# Altium schematic sheet AuxBoard030610.SchDoc
size A3
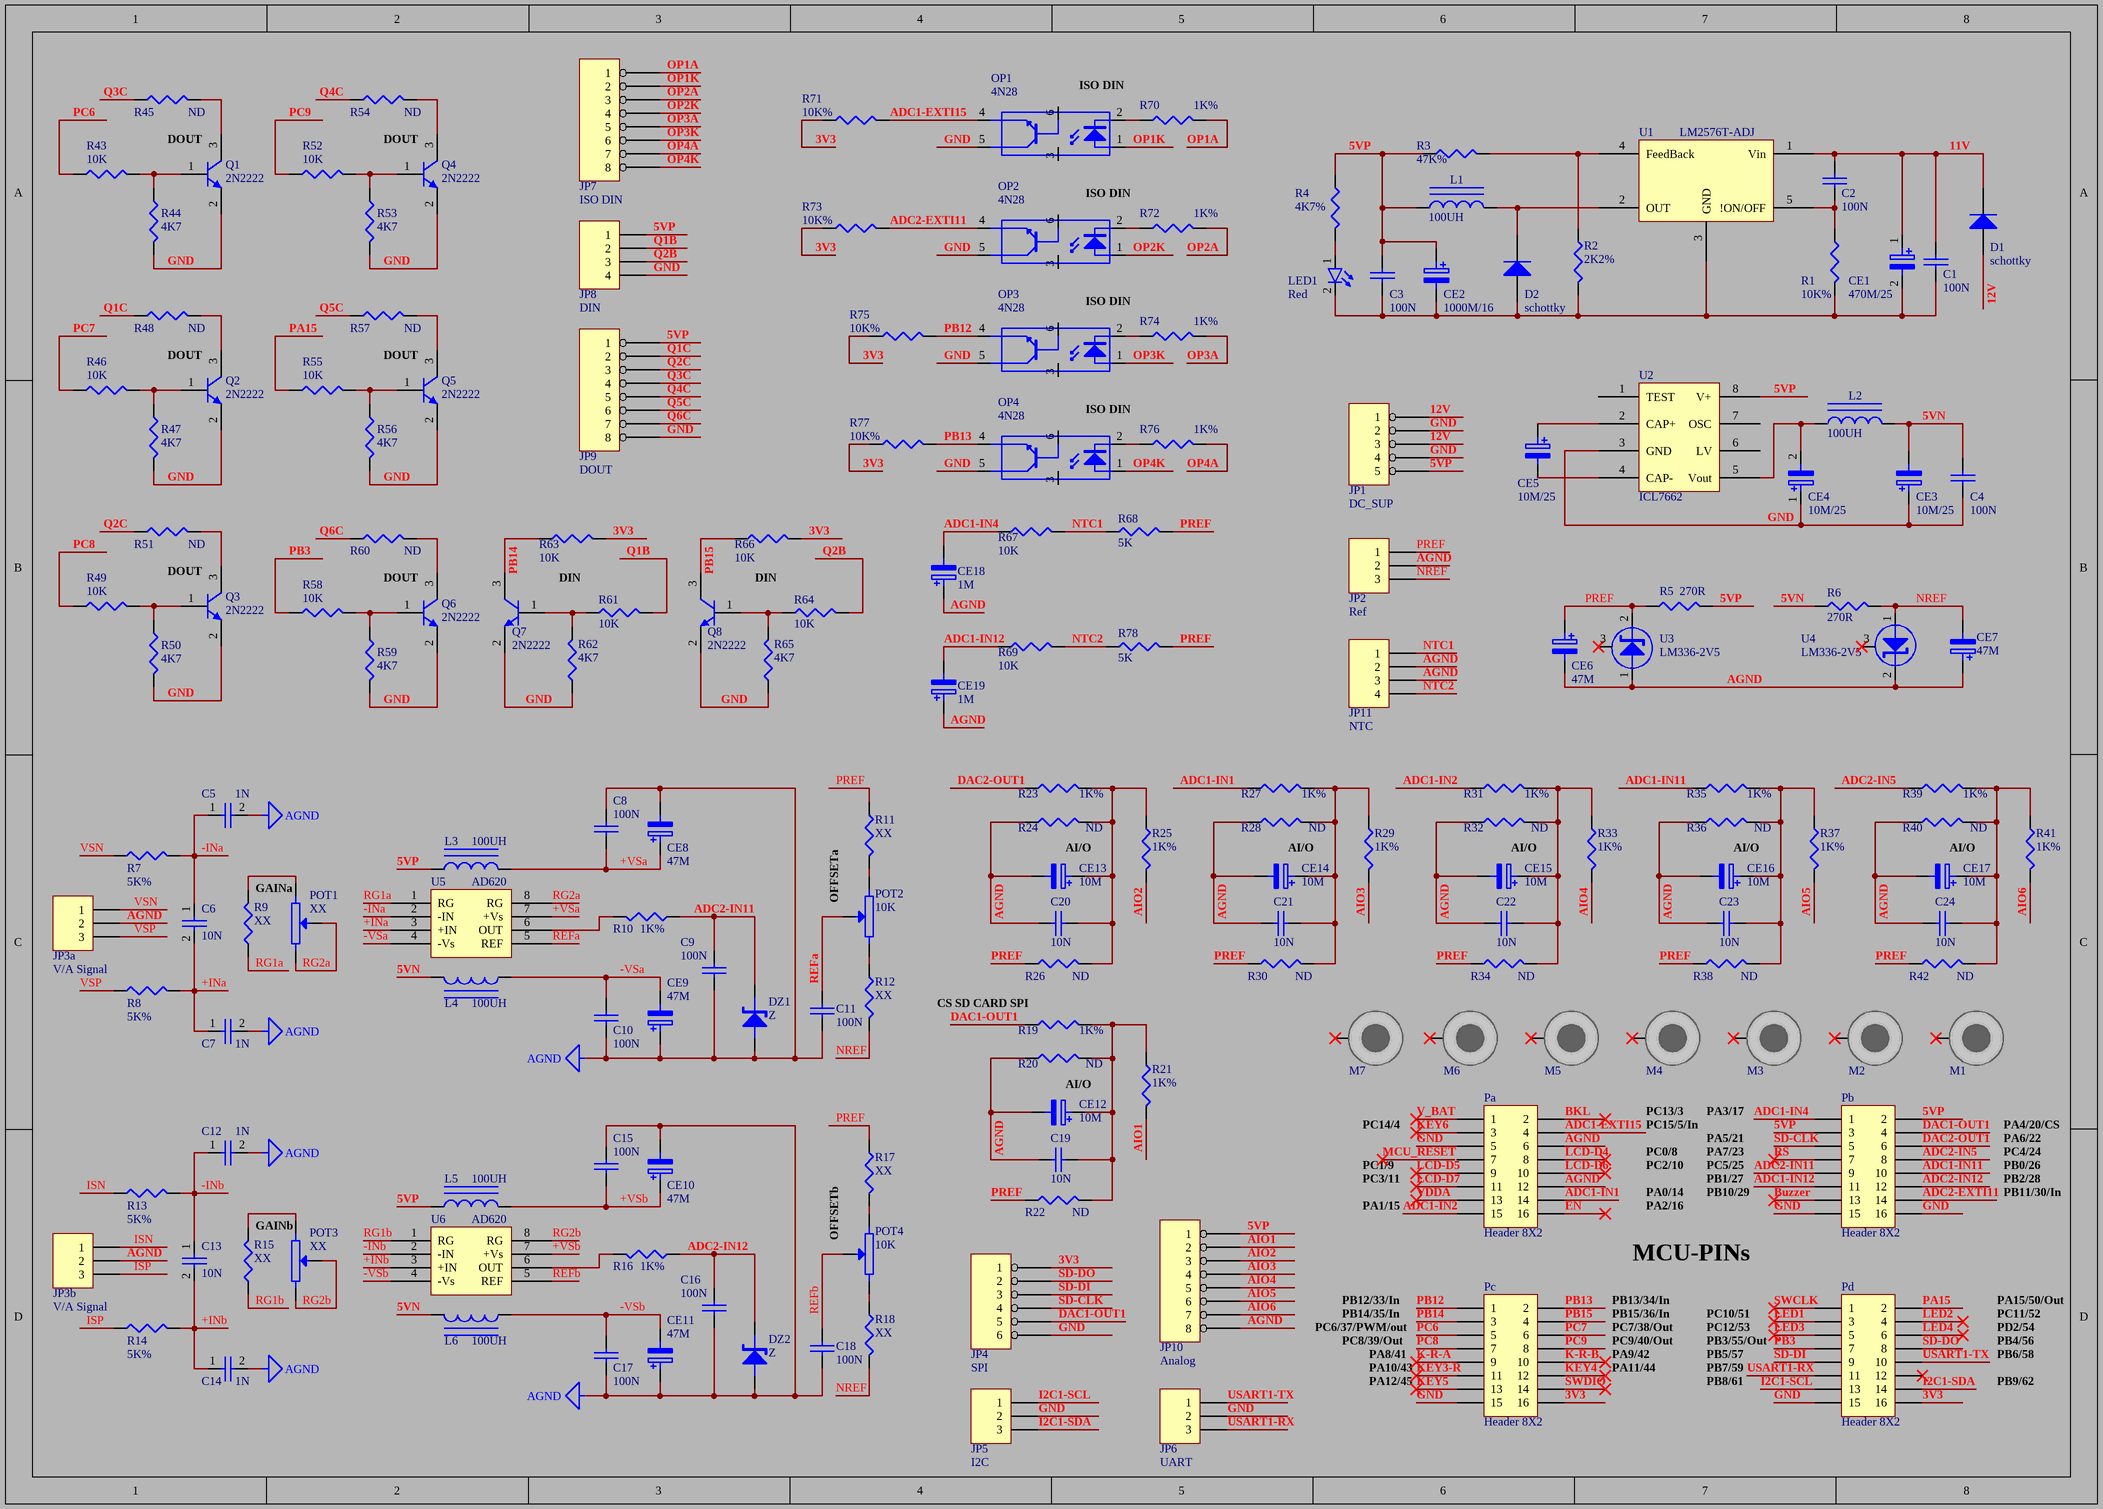
[diagram p0: AuxBoard030610.SchDoc]

## Parts
C1  100N  [C2P]
C2  100N  [SMD_CAP_1206.]
C3  100N  [SMD_CAP_1206.]
C4  100N  [SMD_CAP_1206.]
C5  1N  [SMD_CAP_1206.]
C6  10N  [SMD_CAP_1206.]
C7  1N  [SMD_CAP_1206.]
C8  100N  [SMD_CAP_1206.]
C9  100N  [SMD_CAP_1206.]
C10  100N  [SMD_CAP_1206.]
C11  100N  [SMD_CAP_1206.]
C12  1N  [SMD_CAP_1206.]
C13  10N  [SMD_CAP_1206.]
C14  1N  [SMD_CAP_1206.]
C15  100N  [SMD_CAP_1206.]
C16  100N  [SMD_CAP_1206.]
C17  100N  [SMD_CAP_1206.]
C18  100N  [SMD_CAP_1206.]
C19  10N  [SMD_CAP_1206.]
C20  10N  [SMD_CAP_1206.]
C21  10N  [SMD_CAP_1206.]
C22  10N  [SMD_CAP_1206.]
C23  10N  [SMD_CAP_1206.]
C24  10N  [SMD_CAP_1206.]
CE1  470M/25  [CAP-E-6]
CE2  1000M/16  [CAP-E-6]
CE3  10M/25  [CAP-E-3]
CE4  10M/25  [CAP-E-3]
CE5  10M/25  [CAP-E-3]
CE6  47M  [CAP-E-4]
CE7  47M  [CAP-E-4]
CE8  47M  [CAP-E-4]
CE9  47M  [CAP-E-4]
CE10  47M  [CAP-E-4]
CE11  47M  [CAP-E-4]
CE12  10M  [CAP-E-3]
CE13  10M  [CAP-E-3]
CE14  10M  [CAP-E-3]
CE15  10M  [CAP-E-3]
CE16  10M  [CAP-E-3]
CE17  10M  [CAP-E-3]
CE18  1M  [CAP-E-2]
CE19  1M  [CAP-E-2]
D1  schottky  [SMA-M]
D2  schottky  [SMA-M]
DZ1  Z  [D4P]
DZ2  Z  [D4P]
JP1  DC_SUP  [dsip 5 right]
JP2  Ref  [dsip 3 right]
JP3a  V/A Signal  [dsip 3 right]
JP3b  V/A Signal  [dsip 3 right]
JP4  SPI  [SIP 6 Right]
JP5  I2C  [SIP 3 Right]
JP6  UART  [SIP 3 Right]
JP7  ISO DIN  [dsip 8 right]
JP8  DIN  [dsip 4 right]
JP9  DOUT  [dsip 8 right]
JP10  Analog  [dsip 8 right]
JP11  NTC  [dsip 4 right]
L1  100UH  [INDUCTOR-ylw]
L2  100UH  [r4p]
L3  100UH  [r4p]
L4  100UH  [r4p]
L5  100UH  [r4p]
L6  100UH  [r4p]
LED1  Red  [LED_SMD_1206]
M1  Comment  [Stud-hole]  (value not drawn)  (no BOM)
M2  Comment  [Stud-hole]  (value not drawn)  (no BOM)
M3  Comment  [Stud-hole]  (value not drawn)  (no BOM)
M4  Comment  [Stud-hole]  (value not drawn)  (no BOM)
M5  Comment  [Stud-hole]  (value not drawn)  (no BOM)
M6  Comment  [Stud-hole]  (value not drawn)  (no BOM)
M7  Comment  [Stud-hole]  (value not drawn)  (no BOM)
OP1  4N28  [DIP6]
OP2  4N28  [DIP6]
OP3  4N28  [DIP6]
OP4  4N28  [DIP6]
Pa  Header 8X2  [HDR2X8]
Pb  Header 8X2  [HDR2X8]
Pc  Header 8X2  [HDR2X8]
Pd  Header 8X2  [HDR2X8]
POT1  XX  [pot multi turn]
POT2  10K  [pot multi turn]
POT3  XX  [pot multi turn]
POT4  10K  [pot multi turn]
Q1  2N2222  [2N2222]
Q2  2N2222  [2N2222]
Q3  2N2222  [2N2222]
Q4  2N2222  [2N2222]
Q5  2N2222  [2N2222]
Q6  2N2222  [2N2222]
Q7  2N2222  [2N2222]
Q8  2N2222  [2N2222]
R1  10K%  [RES_1206]
R2  2K2%  [RES_1206]
R3  47K%  [RES_1206]
R4  4K7%  [RES_1206]
R5  270R  [RES_1206]
R6  270R  [RES_1206]
R7  5K%  [R4P]
R8  5K%  [R4P]
R9  XX  [R4P]
R10  1K%  [RES_1206]
R11  XX  [RES_1206]
R12  XX  [RES_1206]
R13  5K%  [R4P]
R14  5K%  [R4P]
R15  XX  [R4P]
R16  1K%  [RES_1206]
R17  XX  [RES_1206]
R18  XX  [RES_1206]
R19  1K%  [RES_1206]
R20  ND  [RES_1206]
R21  1K%  [RES_1206]
R22  ND  [RES_1206]
R23  1K%  [RES_1206]
R24  ND  [RES_1206]
R25  1K%  [RES_1206]
R26  ND  [RES_1206]
R27  1K%  [RES_1206]
R28  ND  [RES_1206]
R29  1K%  [RES_1206]
R30  ND  [RES_1206]
R31  1K%  [RES_1206]
R32  ND  [RES_1206]
R33  1K%  [RES_1206]
R34  ND  [RES_1206]
R35  1K%  [RES_1206]
R36  ND  [RES_1206]
R37  1K%  [RES_1206]
R38  ND  [RES_1206]
R39  1K%  [RES_1206]
R40  ND  [RES_1206]
R41  1K%  [RES_1206]
R42  ND  [RES_1206]
R43  10K  [RES_1206]
R44  4K7  [RES_1206]
R45  ND  [RES_1206]
R46  10K  [RES_1206]
R47  4K7  [RES_1206]
R48  ND  [RES_1206]
R49  10K  [RES_1206]
R50  4K7  [RES_1206]
R51  ND  [RES_1206]
R52  10K  [RES_1206]
R53  4K7  [RES_1206]
R54  ND  [RES_1206]
R55  10K  [RES_1206]
R56  4K7  [RES_1206]
R57  ND  [RES_1206]
R58  10K  [RES_1206]
R59  4K7  [RES_1206]
R60  ND  [RES_1206]
R61  10K  [RES_1206]
R62  4K7  [RES_1206]
R63  10K  [RES_1206]
R64  10K  [RES_1206]
R65  4K7  [RES_1206]
R66  10K  [RES_1206]
R67  10K  [RES_1206]
R68  5K  [RES_1206]
R69  10K  [RES_1206]
R70  1K%  [RES_1206]
R71  10K%  [RES_1206]
R72  1K%  [RES_1206]
R73  10K%  [RES_1206]
R74  1K%  [RES_1206]
R75  10K%  [RES_1206]
R76  1K%  [RES_1206]
R77  10K%  [RES_1206]
R78  5K  [RES_1206]
U1  LM2576T-ADJ  [D2PACK_TO263-5]
U2  ICL7662  [DIP8]
U3  LM336-2V5  [lm336]
U4  LM336-2V5  [lm336]
U5  AD620  [DIP8]
U6  AD620  [DIP8]

## Nets
AGND: C5.2 C7.2 C8.1 C9.2 C10.2 C11.2 C12.2 C14.2 C15.1 C16.2 C17.2 C18.2 C19.2 C20.2 C21.2 C22.2 C23.2 C24.2 CE6.2 CE7.1 CE8.2 CE9.1 CE10.2 CE11.1 CE12.2 CE13.2 CE14.2 CE15.2 CE16.2 CE17.2 CE18.1 CE19.1 DZ1.1(A) DZ2.1(A) JP2.2 JP3a.2 JP3b.2 JP10.8 JP11.2 JP11.3 Pa.6 Pa.12 R20.1 R24.1 R28.1 R32.1 R36.1 R40.1 U3.1 U4.2
3V3: JP4.1 Pc.16 Pd.16 R63.1 R66.1 R71.2 R73.2 R75.2 R77.2
5VN: C4.1 CE3.2 L2.2 L4.1 L6.1 R6.2
5VP: C3.1 CE2.1 JP1.5 JP8.1 JP9.1 JP10.1 L1.1 L3.1 L5.1 Pb.2 Pb.3 R3.1 R4.1 R5.2 U2.8(V+)
11V: C1.1 C2.1 CE1.1 D1.2(K) U1.1(Vin)
12V: D1.1(A) JP1.1 JP1.3
+INa: C6.2 C7.1 R8.2 U5.3(+IN)
+INb: C13.2 C14.1 R14.2 U6.3(+IN)
+VSa: C8.2 CE8.1 L3.2 U5.7(+Vs)
+VSb: C15.2 CE10.1 L5.2 U6.7(+Vs)
-INa: C5.1 C6.1 R7.2 U5.2(-IN)
-INb: C12.1 C13.1 R13.2 U6.2(-IN)
-VSa: C10.1 CE9.2 L4.2 U5.4(-Vs)
-VSb: C17.1 CE11.2 L6.2 U6.4(-Vs)
ADC1-EXTI15: OP1.4(E) Pa.4 R71.1
ADC1-IN1: Pa.14 R27.1
ADC1-IN2: Pa.15 R31.1
ADC1-IN4: CE18.2 Pb.1 R67.2
ADC1-IN11: Pb.10 R35.1
ADC1-IN12: CE19.2 Pb.11 R69.2
ADC2-EXTI11: OP2.4(E) Pb.14 R73.1
ADC2-IN5: Pb.8 R39.1
ADC2-IN11: C9.1 DZ1.2(K) Pb.9 R10.1
ADC2-IN12: C16.1 DZ2.2(K) Pb.12 R16.1
AIO1: JP10.2 R21.2
AIO2: JP10.3 R25.2
AIO3: JP10.4 R29.2
AIO4: JP10.5 R33.2
AIO5: JP10.6 R37.2
AIO6: JP10.7 R41.2
BKL: Pa.2
Buzzer: Pb.13
DAC1-OUT1: JP4.5 Pb.4 R19.1
DAC2-OUT1: Pb.6 R23.1
EN: Pa.16
GND: C4.2 CE3.1 CE4.1 JP1.2 JP1.4 JP4.6 JP5.2 JP6.2 JP8.4 JP9.8 OP1.5(C) OP2.5(C) OP3.5(C) OP4.5(C) Pa.5 Pb.15 Pb.16 Pc.15 Pd.15 Q1.2(E) Q2.2(E) Q3.2(E) Q4.2(E) Q5.2(E) Q6.2(E) Q7.2(E) Q8.2(E) R44.2 R47.2 R50.2 R53.2 R56.2 R59.2 R62.2 R65.2 U2.3(GND)
I2C1-SCL: JP5.1 Pd.13
I2C1-SDA: JP5.3 Pd.14
ISN: JP3b.1 R13.1
ISP: JP3b.3 R14.1
K-R-A: Pc.9
K-R-B: Pc.10
KEY3-R: Pc.11
KEY4: Pc.12
KEY5: Pc.13
KEY6: Pa.3
LCD-D4: Pa.8
LCD-D5: Pa.9
LCD-D6: Pa.10
LCD-D7: Pa.11
LED1: Pd.3
LED2: Pd.4
LED3: Pd.5
LED4: Pd.6
NREF: CE7.2 JP2.3 R6.1 R12.2 R18.2 U4.1
NTC1: JP11.1 R67.1 R68.2
NTC2: JP11.4 R69.1 R78.2
OP1A: JP7.1 R70.1
OP1K: JP7.2 OP1.1(A)
OP2A: JP7.3 R72.1
OP2K: JP7.4 OP2.1(A)
OP3A: JP7.5 R74.1
OP3K: JP7.6 OP3.1(A)
OP4A: JP7.7 R76.1
OP4K: JP7.8 OP4.1(A)
PA15: Pd.2 R55.1
PB3: Pd.7 R58.1
PB12: OP3.4(E) Pc.1 R75.1
PB13: OP4.4(E) Pc.2 R77.1
PB14: Pc.3 Q7.3(C) R63.2
PB15: Pc.4 Q8.3(C) R66.2
PC6: Pc.5 R43.1
PC7: Pc.6 R46.1
PC8: Pc.7 R49.1
PC9: Pc.8 R52.1
PREF: CE6.1 JP2.1 R5.1 R11.1 R17.1 R22.1 R26.1 R30.1 R34.1 R38.1 R42.1 R68.1 R78.1 U3.2
Q1B: JP8.2 R61.1
Q1C: JP9.2 R48.2
Q2B: JP8.3 R64.1
Q2C: JP9.3 R51.2
Q3C: JP9.4 R45.2
Q4C: JP9.5 R54.2
Q5C: JP9.6 R57.2
Q6C: JP9.7 R60.2
REFa: C11.1 POT2.3 U5.5(REF)
REFb: C18.1 POT4.3 U6.5(REF)
RG1a: R9.1 U5.1(RG)
RG1b: R15.1 U6.1(RG)
RG2a: POT1.2 POT1.3 U5.8(RG)
RG2b: POT3.2 POT3.3 U6.8(RG)
RS: Pb.7
SD-CLK: JP4.4 Pb.5
SD-DI: JP4.3 Pd.9
SD-DO: JP4.2 Pd.8
SWCLK: Pd.1
SWDIO: Pc.14
USART1-RX: JP6.3 Pd.11
USART1-TX: JP6.1 Pd.10
V_BAT: Pa.1
VDDA: Pa.13
VSN: JP3a.1 R7.1
VSP: JP3a.3 R8.1
NetC1_2: C1.2 C3.2 CE1.2 CE2.2 D2.1(A) LED1.2(K) R1.2 R2.2 U1.3(GND)
NetC2_2: C2.2 R1.1 U1.5(!ON/OFF)
NetC19_1: C19.1 CE12.1 R19.2 R20.2 R21.1 R22.2
NetC20_1: C20.1 CE13.1 R23.2 R24.2 R25.1 R26.2
NetC21_1: C21.1 CE14.1 R27.2 R28.2 R29.1 R30.2
NetC22_1: C22.1 CE15.1 R31.2 R32.2 R33.1 R34.2
NetC23_1: C23.1 CE16.1 R35.2 R36.2 R37.1 R38.2
NetC24_1: C24.1 CE17.1 R39.2 R40.2 R41.1 R42.2
NetCE4_2: CE4.2 L2.1 U2.5(Vout)
NetCE5_1: CE5.1 U2.2(CAP+)
NetCE5_2: CE5.2 U2.4(CAP-)
NetD2_2: D2.2(K) L1.2 U1.2(OUT)
NetLED1_1: LED1.1(A) R4.2
NetOP1_2: OP1.2(K) R70.2
NetOP2_2: OP2.2(K) R72.2
NetOP3_2: OP3.2(K) R74.2
NetOP4_2: OP4.2(K) R76.2
NetPOT1_1: POT1.1 R9.2
NetPOT2_1: POT2.1 R11.2
NetPOT2_2: POT2.2 R12.1
NetPOT3_1: POT3.1 R15.2
NetPOT4_1: POT4.1 R17.2
NetPOT4_2: POT4.2 R18.1
NetQ1_1: Q1.1(B) R43.2 R44.1
NetQ1_3: Q1.3(C) R45.1
NetQ2_1: Q2.1(B) R46.2 R47.1
NetQ2_3: Q2.3(C) R48.1
NetQ3_1: Q3.1(B) R49.2 R50.1
NetQ3_3: Q3.3(C) R51.1
NetQ4_1: Q4.1(B) R52.2 R53.1
NetQ4_3: Q4.3(C) R54.1
NetQ5_1: Q5.1(B) R55.2 R56.1
NetQ5_3: Q5.3(C) R57.1
NetQ6_1: Q6.1(B) R58.2 R59.1
NetQ6_3: Q6.3(C) R60.1
NetQ7_1: Q7.1(B) R61.2 R62.1
NetQ8_1: Q8.1(B) R64.2 R65.1
NetR2_1: R2.1 R3.2 U1.4(FeedBack)
NetR10_2: R10.2 U5.6(OUT)
NetR16_2: R16.2 U6.6(OUT)

Not connected (* = marked no-connect by the designer): M1 1*; M2 1*; M3 1*; M4 1*; M5 1*; M6 1*; M7 1*; OP1 3(NC) 6(B); OP2 3(NC) 6(B); OP3 3(NC) 6(B); OP4 3(NC) 6(B); Pa 7; Pd 12*; U2 1(TEST) 6(LV) 7(OSC); U3 3*; U4 3*

## Notes on the sheet
- (near OP1) ISO DIN
- DOUT
- ISO DIN
- DIN
- AI/O
- GAINa
- (near POT2) OFFSETa
- (near R19) CS SD CARD SPI
- PC14/4
- PC13/3
- PC15/5/In
- PA3/17
- PA4/20/CS
- PC1/9
- PC3/11
- PC0/8
- PC2/10
- PA5/21
- PA7/23
- PC5/25
- PB1/27
- PA6/22
- PC4/24
- PB0/26
- PB2/28
- GAINb
- (near POT4) OFFSETb
- PA1/15
- MCU-PINs
- PA2/16
- PA0/14
- PB10/29
- PB11/30/In
- PB14/35/In
- PB12/33/In
- PB13/34/In
- PB15/36/In
- PC10/51
- PC11/52
- PA15/50/Out
- PC6/37/PWM/out
- PC8/39/Out
- PA8/41
- PA10/43
- PA12/45
- PA9/42
- PA11/44
- PC7/38/Out
- PC9/40/Out
- PC12/53
- PB5/57
- PB8/61
- PB7/59
- PB3/55/Out
- PD2/54
- PB4/56
- PB9/62
- PB6/58

## Library data of the parts
C1-C24 = C
CE1-CE19 = E
D1 D2 = Diode: Default Diode; Published: 8-Jun-2000; LatestRevisionDate: 17-Jul-2002; LatestRevisionNote: Re-released for DXP Platform.; PackageVersion: Sep-1996; PackageReference: SMC; Publisher: Altium Limited; PackageDescription: DO-214-AB/SMC; 2 C-Bend Leads; Body 7.9 x 5.9 mm, inc. leads (LxW); Code_JEDEC: DO-214-AB
JP1 = HEADER 5
JP2 JP3a JP3b JP5 JP6 = Header 3: Header, 3-Pin; LatestRevisionDate: 17-Jul-2002; LatestRevisionNote: Re-released for DXP Platform.; Publisher: Altium Limited
JP4 = HEADER 6
JP7 JP9 JP10 = HEADER 8
JP8 JP11 = Header 4: Header, 4-Pin; LatestRevisionDate: 17-Jul-2002; LatestRevisionNote: Re-released for DXP Platform.; Publisher: Altium Limited
L1-L6 = INDUCTOR IRON
LED1 = LED: Designer: Saeid Jorablo; Organazation: ControTec; Adding Date: 1387/12/22; Color: Red; Size: SMD 1206
M1-M7 = SCMH_M1P6: SCREW mouting, M1.6, 1.6mm diameter and 3.2mm PanHead; VALUE: DNP/MH; ASSEMBLY: DNP
OP1-OP4 = OPTODIP6
Pa Pb Pc Pd = Header 8X2: Header, 8-Pin, Dual row; LatestRevisionDate: 17-Jul-2002; LatestRevisionNote: Re-released for DXP Platform.; Publisher: Altium Limited
POT1-POT4 = POT2
Q1-Q8 = 1FW: NPN; Published: 8-Jun-2000; LatestRevisionDate: 15-Jan-2003; LatestRevisionNote: PCB Footprint 'BCY-W3/D4.7' replaced; DatasheetVersion: 1997; PackageVersion: Sep-1998; PackageReference: TO-92A; Publisher: Altium Limited; PackageDescription: TO, Flat Index; 3 In-Line, Axial Leads; Body Dia. 4.5mm; Leads 0.51 x 0.48 mm (max); ComponentLink1Description: Datasheet; ComponentLink1URL: http://www.farnell.com/datasheets/1685012.pdf
R1-R78 = R
U1 = LM2576
U3 U4 = LM336